# EAGLE design DCC-IPG_tinyVersion_60µs_100µA_Q3_2018 (EAGLE 6.5.0)
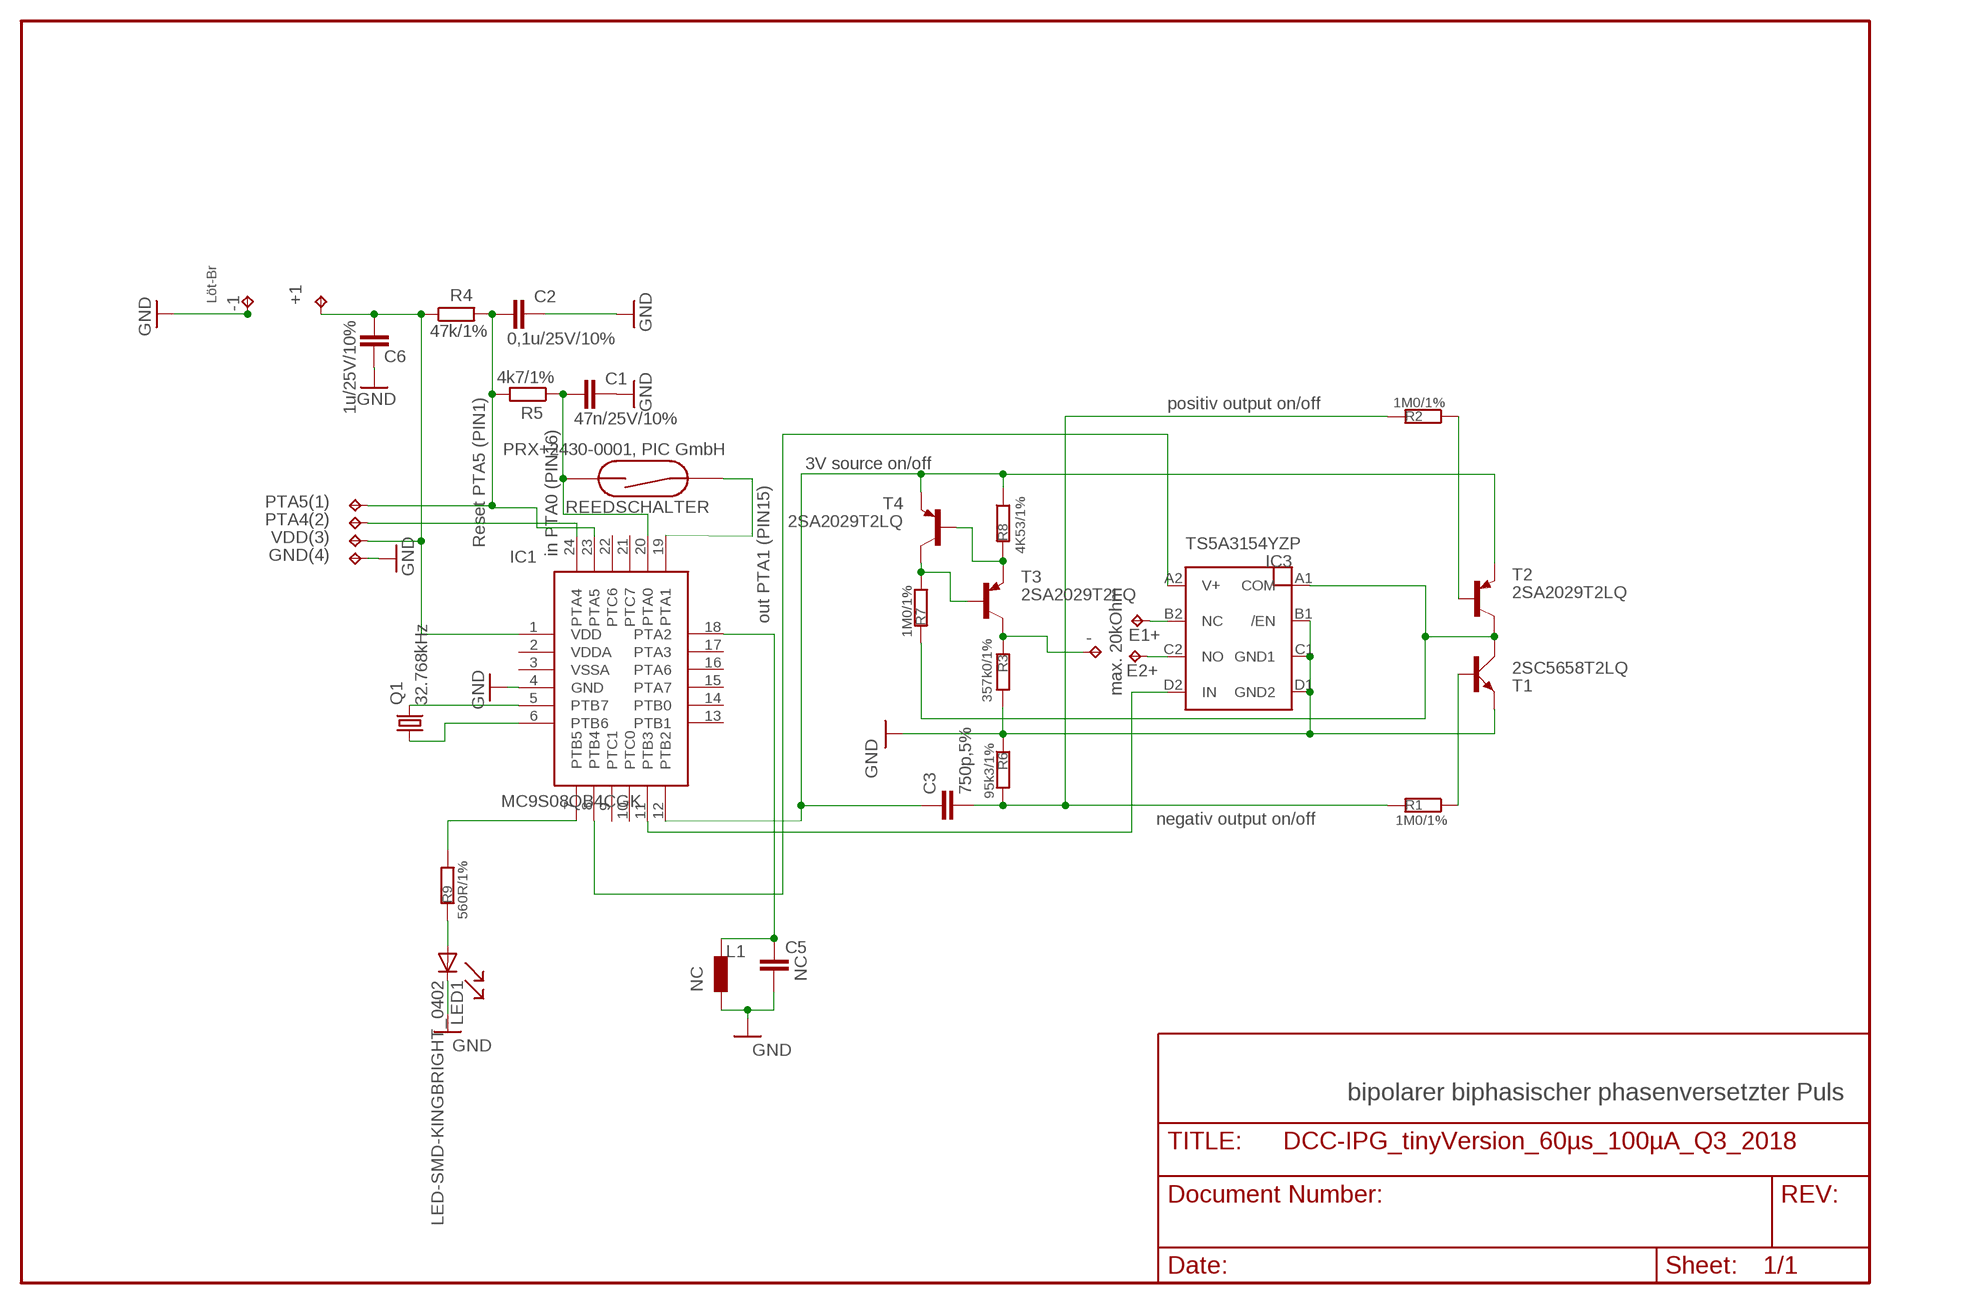
[diagram p0: schematic, sheet 1]

## Parts
+1  TPTP11SQ  [TP11SQ]
-  TPTP07SQ  [TP07SQ]
-1  TPTP11SQ  [TP11SQ]
C1  47n/25V/10%  C-EUC0201  [C0201]
C2  0,1u/25V/10%  C-EUC0201  [C0201]
C3  750p,5%  C-EUC0201  [C0201]
C5  NC  C-EUC1608  [C1608]
C6  1u/25V/10%  C-EUC0201  [C0201]
E1+  TPTP07SQ  [TP07SQ]
E2+  TPTP07SQ  [TP07SQ]
GND(4)  TPTP04SQ  [TP04SQ]
IC1  MC9S08QB4CGK  MC9S08QB4  [QFN_24]
IC3  TS5A3154YZP  [WCSP]
LED1  LED-SMD-KINGBRIGHT_0402  LED-SMD-KINGBRIGHT  [LED_0403]
PTA4(2)  TPTP04SQ  [TP04SQ]
PTA5(1)  TPTP04SQ  [TP04SQ]
Q1  32.768kHz  CRYSTAL001"  [SMT]
R1  1M0/1%  R-EU_R0201  [R0201]
R2  1M0/1%  R-EU_R0201  [R0201]
R3  357k0/1%  R-EU_R0201  [R0201]
R4  47k/1%  R-EU_R0201  [R0201]
R5  4k7/1%  R-EU_R0201  [R0201]
R6  95k3/1%  R-EU_R0201  [R0201]
R7  1M0/1%  R-EU_R0201  [R0201]
R8  4K53/1%  R-EU_R0201  [R0201]
R9  560R/1%  R-EU_R0201  [R0201]
REEDSCHALTER  PRX+2430-0001, PIC GmbH  REED-SWITCH510  [PRX+2452]
T1  2SC5658T2LQ  [VMT3]
T2  2SA2029T2LQ  [VMT3]
T3  2SA2029T2LQ  [VMT3]
T4  2SA2029T2LQ  [VMT3]
VDD(3)  TPTP04SQ  [TP04SQ]

## Nets
3V_SOURCE_ON_OFF: C3.1 IC1.12(PTB2) R8.1 T2.E T4.E
ANALOG_SWITCH: IC1.8(PTB4) IC3.A2(V+)
ANALOG_SWITCH_DIRECTION: IC1.11(PTB3) IC3.D2(IN)
CURRENT_IN: IC3.A1(COM) R7.2 T1.C T2.C
CURRENT_SWITCHES: C3.2 R1.2 R2.2 R6.2
ELECTRODE_1+: E1+.TP IC3.B2(NC)
ELECTRODE_2+: E2+.TP IC3.C2(NO)
GND: -1.TP C1.1 C2.1 C5.2 C6.1 GND(4).P$1(TP) IC1.4(GND) IC3.B1(/EN) IC3.C1(GND1) IC3.D1(GND2) LED1.C R3.2 R6.1 T1.E
N$1: R1.1 T1.B
N$2: R2.1 T2.B
N$3: IC1.7(PTB5) R9.1
N$4: IC1.19(PTA1) REEDSCHALTER.P$1
N$5: R8.2 T3.E T4.B
N$6: C5.1 IC1.18(PTA2)
N$7: IC1.5(PTB7) Q1.P$2
N$8: LED1.A R9.2
N$9: IC1.6(PTB6) Q1.P$1
N$10: IC1.24(PTA4) PTA4(2).P$1(TP)
N$16: R7.1 T3.B T4.C
REF.-OUT: -.TP R3.1 T3.C
S$9: C1.2 IC1.20(PTA0) R5.1 REEDSCHALTER.P$2
S$12: C2.2 IC1.23(PTA5) PTA5(1).P$1(TP) R4.2 R5.2
VDD: +1.TP C6.2 IC1.1(VDD) R4.1 VDD(3).P$1(TP)
Unconnected: IC1.2(VDDA) IC1.3(VSSA) IC1.9(PTC1) IC1.10(PTC0) IC1.13(PTB1) IC1.14(PTB0) IC1.15(PTA7) IC1.16(PTA6) IC1.17(PTA3) IC1.21(PTC7) IC1.22(PTC6)

## Notes on the sheet
- Löt-Br
- positiv output on/off
- in PTA0 (PIN16)
- 3V source on/off
- Reset PTA5 (PIN1)
- max. 20kOhm
- out PTA1 (PIN15)
- negativ output on/off
- L1
- NC
- bipolarer biphasischer phasenversetzter Puls

## Library data of the parts
+1 - -1 E1+ E2+ GND(4) PTA4(2) PTA5(1) VDD(3) = testpad:TP: Test pad
C1-C3 C5 C6 = rcl:C-EU: CAPACITOR, European symbol
IC1 = DBS-Eagle-Bibliothek:MC9S08QB4: MC9S08QB8 Series Covers: MC9S08QB8 and MC9S08QB4
IC3 = DBS-Eagle-Bibliothek:TS5A3154: 5-V/3.3-V SINGLE-CHANNEL 2:1 MULTIPLEXER/DEMULTIPLEXER Texas Instruments
LED1 = Eigene-Eagle-Bibliothek:LED-SMD-KINGBRIGHT: LED Kingbright, KPHHS-1005MGCK
Q1 = MTL-Eagle-Bibliothek:CRYSTAL: CRYSTAL
R1-R9 = rcl:R-EU_: RESISTOR, European symbol
REEDSCHALTER = MTL-Eagle-Bibliothek:REED-SWITCH: Reed-Schalter PRX-Series
T1 = MTL-Eagle-Bibliothek:2SC5658: General purpose transistor NPN, 50V, 0,15A
T2-T4 = Eigene-Eagle-Bibliothek:2SA2029: General purpose transistor PNP, -50V, -0,15A

## Board
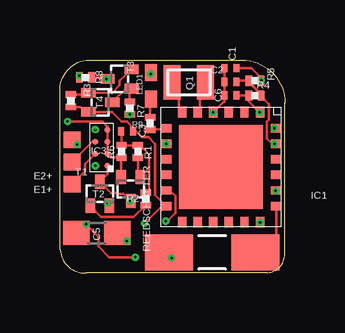
[diagram p1: board, top side]
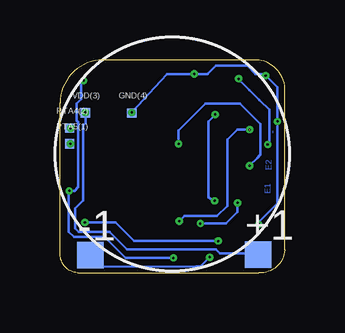
[diagram p2: board, bottom side, seen from below]

Size 9.39 x 8.88 mm. Coordinates in mm from the lower left corner, seen from the top.
Outline: 0.02,0.95 0,7.7
Outline: 1.33,8.88 7.6,8.88
Outline: 8.65,0 1.6,0 1.18,0 1.09,0 arc-90 0.01,0.96
Outline: 9.39,0.83 9.39,7.1
Outline: 7.59,8.88 arc-90 9.39,7.08
Outline: 0,7.7 arc-90 1.33,8.88
Outline: 8.66,0 arc90 9.39,0.85
Copper layers (1*2+3*4+5*6+7*16): Top 0.035mm / dielectric 0.2mm / Route2 0.035mm / dielectric 0.15mm / Route3 0.035mm / dielectric 0.2mm / Route4 0.035mm / dielectric 0.15mm / Route5 0.035mm / dielectric 0.2mm / Route6 0.035mm / dielectric 0.15mm / Route7 0.035mm / dielectric 0.2mm / Bottom 0.035mm
Design rules "Eagle_WEdirekt_100_check *": minimum track width 0.1mm, minimum drill 0.2mm, track to track 0.1mm, track to pad 0.1mm, pad to pad 0.175mm, via to via 0.1mm, smd to smd 0.175mm, copper to edge 0.3mm, drill to drill 0.6mm, minimum pad ring 0.225mm, minimum via ring 0.1mm, stop-mask expansion 0.05mm, vias tented up to drill 0mil, thermal gap 0.3mm

### Footprints (pad centres in the part's own frame; a part is rotated, then mirrored left to right if it is on the bottom)
TP11SQ = smd 1.1 x 1.1: TP 0,0
TP07SQ = smd 0.7 x 0.7: TP 0,0
C0201 = smd 0.25 x 0.35: 1 -0.25,0; 2 0.25,0
C1608 = smd 1.1 x 1: 1 -0.85,0; 2 0.85,0
TP04SQ = smd 0.381 x 0.381: P$1 0,0
QFN_24 = smd 0.45 x 0.35: 1 -2.3,1.625; 2 -2.3,0.975; 3 -2.3,0.325; 4 -2.3,-0.325; 5 -2.3,-0.975; 6 -2.3,-1.625; 13 2.3,-1.625; 14 2.3,-0.975; 15 2.3,-0.325; 16 2.3,0.325; 17 2.3,0.975; 18 2.3,1.625 | smd 0.35 x 0.45: 7 -1.625,-2.3; 8 -0.975,-2.3; 9 -0.325,-2.3; 10 0.325,-2.3; 11 0.975,-2.3; 12 1.625,-2.3; 19 1.625,2.3; 20 0.975,2.3; 21 0.325,2.3; 22 -0.325,2.3; 23 -0.975,2.3; 24 -1.625,2.3 | smd 3.5 x 3.5: ATTACH-PAD 0,0
WCSP = smd 0.25 x 0.25: A1 0.25,-0.75; A2 -0.25,-0.75; B1 0.25,-0.25; B2 -0.25,-0.25; C1 0.25,0.25; C2 -0.25,0.25; D1 0.25,0.75; D2 -0.25,0.75
LED_0403 = smd 0.7 x 0.5: A -0.55,0; C 0.55,0
SMT = smd 0.711 x 1.422: P$1 -0.7,0; P$2 0.7,0
R0201 = smd 0.28 x 0.43: 1 -0.255,0; 2 0.255,0
PRX+2452 = smd 2 x 1.5: P$1 -1.7,0; P$2 1.9,0
VMT3 = smd 0.4 x 0.6: B -0.4,-0.5; C 0,0.5; E 0.4,-0.5

### Placement (x,y rotation side)
+1  1.12,0.76 0 bottom
-  0.51,5.55 0 top
-1  8.12,0.73 0 bottom
C1  7.11,8.54 0 top
C2  7.11,7.97 0 top
C3  2.81,5.9 180 top
C5  1.54,1.67 180 top
C6  7.11,7.4 0 top
E1+  0.51,3.69 0 top
E2+  0.51,4.62 0 top
GND(4)  6.4,6.67 0 bottom
IC1  6.72,4.41 270 top
IC3  1.73,5.22 0 top
LED1  3.79,7.8 90 top
PTA4(2)  8.99,6.03 0 bottom
PTA5(1)  8.99,5.38 0 bottom
Q1  5.38,7.95 0 top
R1  3.26,5.06 90 top
R2  3.58,3.08 90 top
R3  1.07,8.15 180 top
R4  8.14,7.39 0 top
R5  8.14,8.02 180 top
R6  2.58,5.06 90 top
R7  2.91,6.87 270 top
R8  0.46,7.18 90 top
R9  3.77,6.24 90 top
REEDSCHALTER  6.45,0.86 180 top
T1  2.95,3.5 180 top
T2  1.66,3.3 0 top
T3  2.49,8.09 90 top
T4  1.68,7.12 270 top
VDD(3)  8.33,6.67 0 bottom

### Tracks (layer width: path | path; a pad name or v marks a point on that pad's centre or on a via)
3V_SOURCE_ON_OFF  (via drill 0.1 pad 0.12)
  Top 0.1: T4.E 0.84,6.92 R8.1 | 3.96,3.25 3.96,4.2 3.96,5.38 3.71,5.66 3.42,5.66 | T2.E v1.98,2.92
  Top 0.102: 3.96,3.25 IC1.12 4.27,2.79 3.64,2.16 v3.53,2.06 | T4.E 2.17,6.71 2.57,6.31 2.71,6.31 2.8,6.31 3.06,6.05 C3.1 3.18,5.9 3.42,5.66
  Bottom 0.1: 1.98,2.55 v1.98,2.92
  Bottom 0.102: 1.98,2.55 2.47,2.06 v3.53,2.06
ANALOG_SWITCH  (via drill 0.1 pad 0.12, 0.1 pad 0.25)  (1 unrouted)
  Top 0.1: IC1.8 4.4,5.39 v4.44,5.38
  Bottom 0.1: IC1.8 v4.44,5.38
  Bottom 0.102: v4.44,5.38 v4.44,5.39 4.44,5.94 3.33,7.05 1.87,7.05 1.02,6.2 1.02,4.93 1.16,4.8 IC3.A2
  other vias: 1.48,4.47
ANALOG_SWITCH_DIRECTION  (via drill 0.1 pad 0.12)  (2 unrouted)
  Top 0.1: IC1.11 4.58,3.44 4.82,3.2 4.82,2.51 4.46,2.15 v4.41,2.15
  Bottom 0.1: 2.4,5.55 2.4,2.8 2.83,2.37 4.2,2.37 v4.41,2.15
  Bottom 0.102: 2.4,5.55 1.98,5.98 v1.48,5.98
CURRENT_IN  (via drill 0.1 pad 0.12)
  Top 0.1: 2.92,6.59 v2.91,6.61 R7.2 2.91,6.59 | 2.38,3.34 2.42,3.3 2.65,3.3 T1.C v2.93,3
  Top 0.102: 2.38,3.34 2.14,3.34 T2.C 1.98,4.13 IC3.A1
  Bottom 0.1: v2.91,6.61 3.2,6.32 3.2,3.14 T1.C v2.93,3
CURRENT_SWITCHES
  Top 0.1: R6.2 2.64,5.31 R1.2 3.53,5.14 3.73,4.95 3.73,3.44 3.7,3.4 3.6,3.4 R2.2
  Top 0.102: C3.2 2.58,5.88 R6.2
ELECTRODE_1+
  Top 0.102: E1+.TP 1.06,4.24 1.06,4.55 IC3.B2
ELECTRODE_2+
  Top 0.102: 0.51,4.74 E2+.TP 1.36,5.47 IC3.C2
GND  (via drill 0.1 pad 0.12)
  Top 0.1: 3.79,8.22 LED1.C v3.79,8.3 | 0.45,6.32 v0.32,6.32 | IC1.4 v6.4,6.69 6.79,7.08 | 2.55,4.65 T1.E | R6.1 2.54,4.74 | v1.09,2.02 0.86,2.04 0.84,2.05 0.7,1.7 | 0.7,1.7 C5.2 | C5.2 0.7,1.7
  Top 0.102: 6.79,7.08 6.86,7.15 C6.1 6.86,7.43 C2.1 6.86,8.57 C1.1 | 0.45,6.32 1.77,6.32 1.98,6.11 IC3.D1 IC3.C1 IC3.B1 2.14,4.81 R6.1 2.56,4.65 2.55,4.65 | v0.81,8.23 0.7,8.17 R3.2 | v3.14,0.65 2.06,0.65 1.62,1.09 1.62,1.5 v1.09,2.02
  Bottom 0.1: 3.23,8.3 v3.79,8.3 4.93,8.3 v6.4,6.69 | -1.TP 8.16,0.32 8.27,0.29 8.16,0.25 3.69,0.26 3.53,0.26 v3.14,0.65
  Bottom 0.102: 3.23,8.3 3.23,8.31 2.88,8.65 1.58,8.65 1.23,8.3 0.91,8.3 v0.81,8.23 0.32,7.74 0.33,7.6 v0.32,6.32 0.32,2.9 1.1,2.12 v1.09,2.02 | GND(4).P$1 v6.4,6.69
N$1
  Top 0.102: T1.B 3.26,4.09 R1.1
N$2
  Top 0.102: T2.B 1.72,2.34 3.08,2.33 R2.1
N$3
  Top 0.1: IC1.7 4.43,6 R9.1
N$4
  Top 0.1: IC1.19 9.02,1.47 8.43,0.88 8.35,0.88 8.3,0.9 8.2,0.9 REEDSCHALTER.P$1
N$5
  Top 0.1: R8.2 0.91,7.43 T4.B | 1.09,7.43 T4.B | 1.01,7.56 T4.B
  Top 0.102: T4.B 2.18,7.51 2.49,7.83 2.49,8.01 T3.E
N$6  (via drill 0.1 pad 0.12)
  Top 0.1: v8.35,2.1 IC1.18 | v2.79,1.33 2.67,1.44 2.53,1.6 C5.1
  Bottom 0.102: v8.35,2.1 7.07,2.1 6.29,1.33 v2.79,1.33
N$7
  Top 0.1: Q1.P$2 6.09,7.96 | IC1.5 5.85,6.71 5.85,7.72 Q1.P$2 | 5.88,7.69 6.03,7.86 Q1.P$2
N$8
  Top 0.1: LED1.A 3.71,7.19 | 3.79,7.19 LED1.A | R9.2 3.77,7.17 LED1.A
N$9
  Top 0.1: 4.75,7.65 Q1.P$1 4.98,7.74 4.98,7.43 4.98,6.8 IC1.6
N$10  (via drill 0.1 pad 0.1)
  Top 0.102: v8.95,6.04 IC1.24
  Bottom 0.102: PTA4(2).P$1 v8.95,6.04
N$16
  Top 0.1: R7.1 2.91,7.7 T3.B 2.77,7.69 T4.C
REF.-OUT  (via drill 0.1 pad 0.25)
  Top 0.1: 1.94,8.09 T3.C 1.9,8.2 1.89,8.15 | 1.95,8.11 1.93,8.12 1.89,8.15 | 1.89,8.15 R3.1
  Top 0.102: -.TP v0.72,5.35 | v1.94,8.1 T3.C
  Bottom 0.102: v0.72,5.35 0.66,5.46 0.65,6.1 0.66,6.81 1.07,7.22 1.48,7.63 1.94,8.09 v1.94,8.1
S$9  (via drill 0.1 pad 0.12)
  Top 0.1: v9,3.42 IC1.20 | v4.66,0.62 REEDSCHALTER.P$2
  Top 0.102: R5.1 v8.4,8.02 8.4,8.13 7.99,8.54 C1.2
  Bottom 0.1: v8.4,8.02 8.51,7.95 8.51,7.25 8.69,7.07 8.69,6.36 8.67,6.34 8.63,6.3 8.63,3.58 8.79,3.42 v9,3.42 | 6.66,0.62 v4.66,0.62
  Bottom 0.102: 6.66,0.62 7.54,1.49 8.81,1.49 9.03,1.72 9.03,3.39 v9,3.42
S$12  (via drill 0.1 pad 0.28)
  Top 0.1: IC1.23 9,5.36 | 7.85,8 R5.2
  Top 0.102: R4.2 8.4,7.37 8.71,7.05 8.71,6.39 8.64,6.31 8.64,5.61 8.88,5.36 IC1.23 v8.95,5.39 | R4.2 8.4,7.51 | R4.2 8.4,7.43 | R4.2 8.37,7.44 7.9,7.97 7.89,7.98 7.89,8.03 R5.2 7.38,8.02 C2.2
  Bottom 0.102: v8.95,5.39 PTA5(1).P$1
VDD  (via drill 0.1 pad 0.12)
  Top 0.1: 8.31,6.71 v8.33,6.69 IC1.1
  Top 0.102: 8.31,6.71 7.89,7.14 R4.1 | R4.1 7.86,7.43 | C6.2 7.4,7.39 R4.1
  Bottom 0.1: 8.77,2.68 8.77,2.04 | +1.TP 0.84,0.82 0.93,0.82 2.71,0.82 2.87,0.98 6.58,0.97
  Bottom 0.102: 6.58,0.97 7.31,1.7 8.43,1.7 8.61,1.7 8.77,1.85 8.77,2.04 | VDD(3).P$1 v8.33,6.69 8.33,6.25 8.43,6.15 8.43,3.02 8.77,2.68

### Text on the board
Bottom: E2 | E1